# Altium schematic sheet Compute_Module_POWER.SchDoc: STM32F446 CNC
size B; Author: AM; CompanyName: Expatria Technologies; DrawnBy: A.Marles; Engineer: AM; Organization: Expatria Technolgoies; Address1: 1136 Glade Court; Address3: Port Coquitlam, BC V3B 1R5; Address4: Canada; DocumentNumber: 9; SheetNumber: 9; SheetTotal: 30
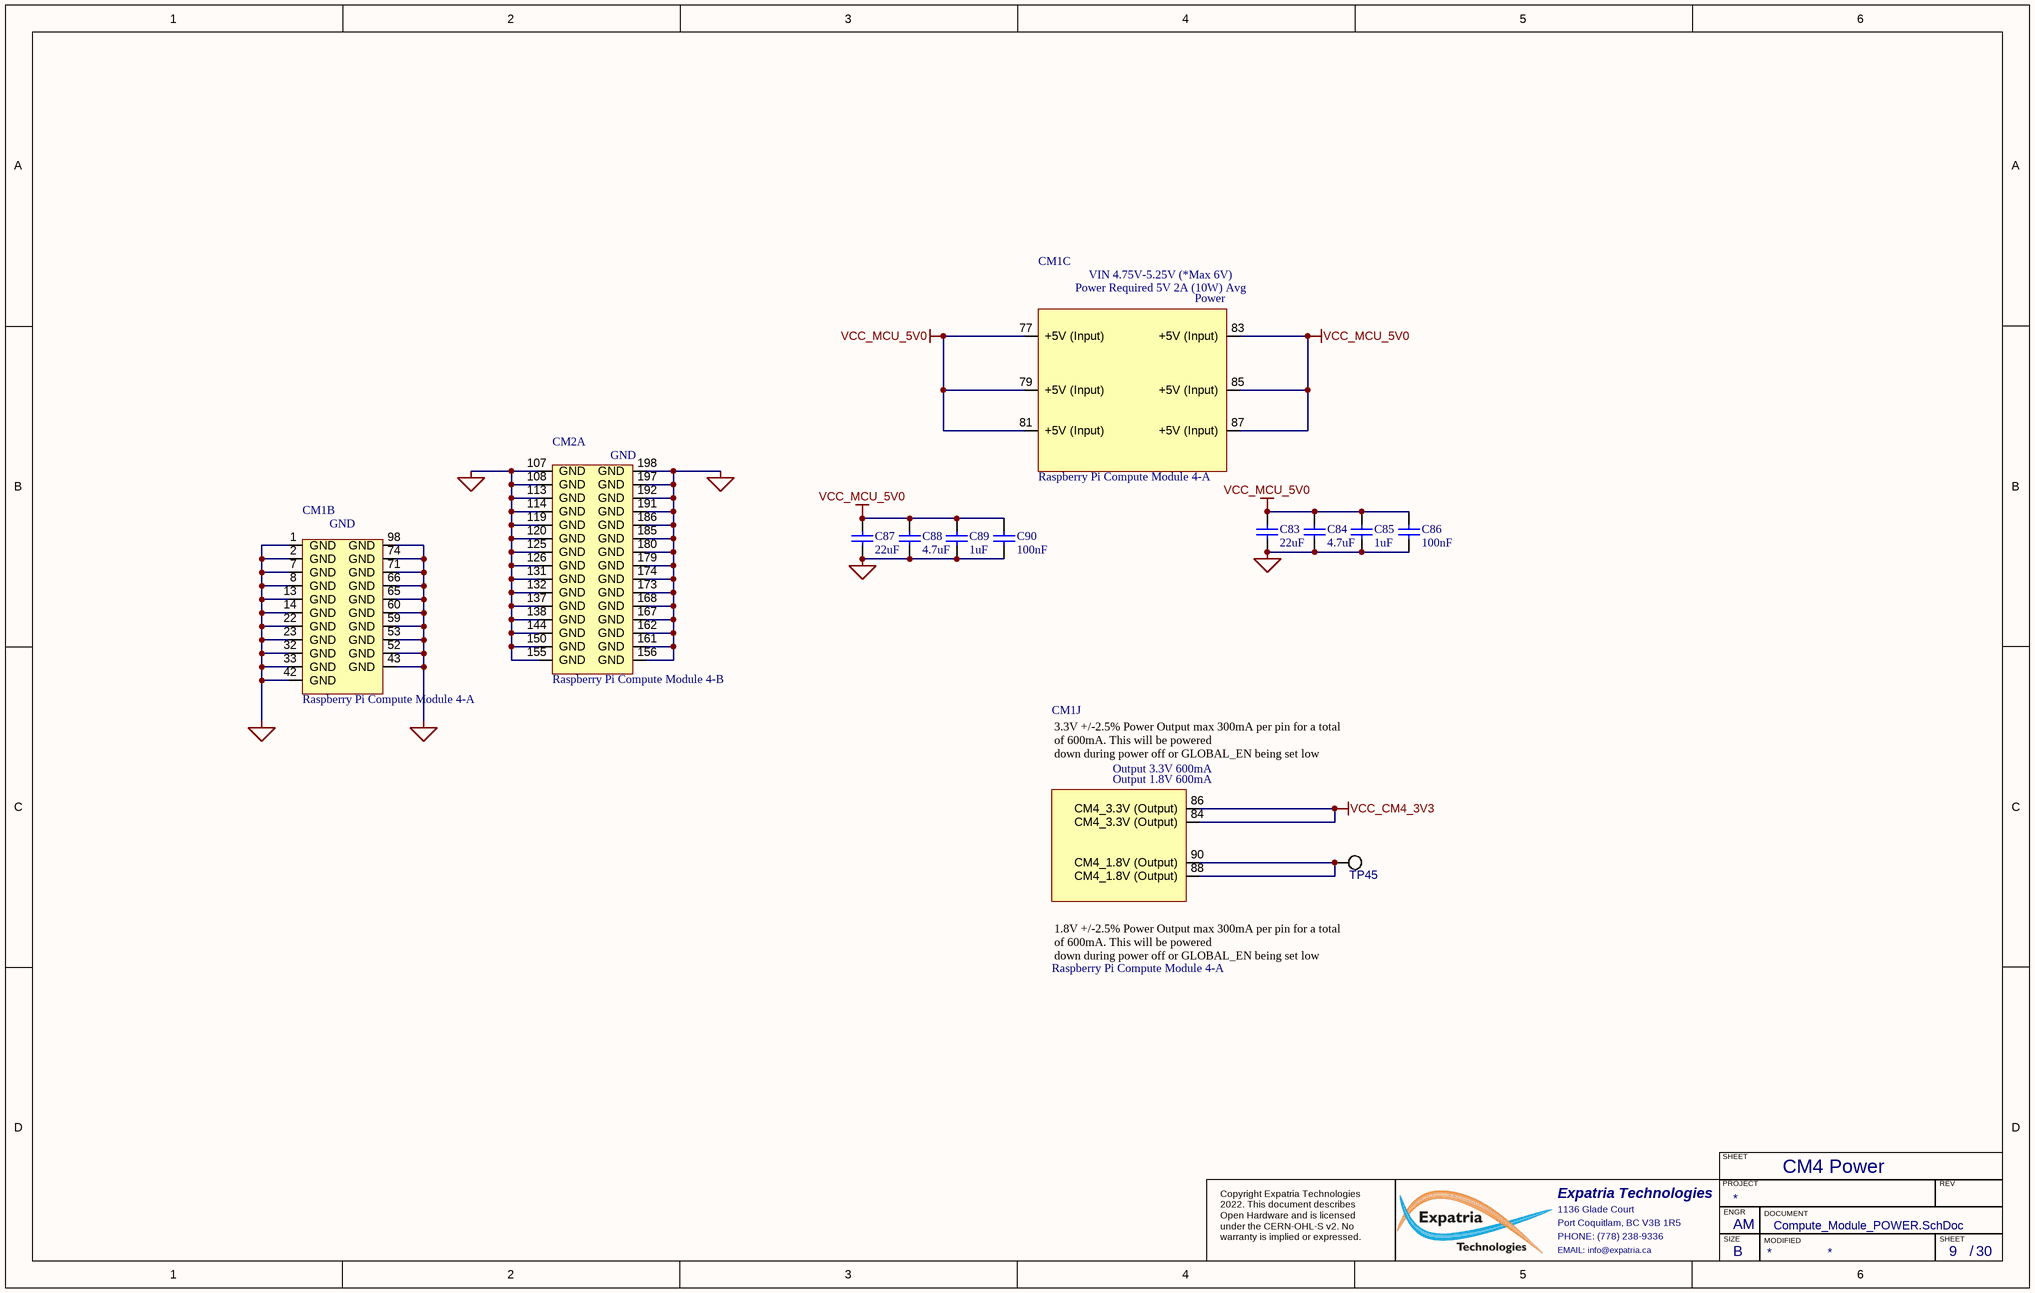
[diagram p0: Compute_Module_POWER.SchDoc]

## Parts
C83  22uF  [0805_C]
C84  4.7uF  [0603_C]
C85  1uF  [0603_C]
C86  100nF  [0603_C]
C87  22uF  [0805_C]
C88  4.7uF  [0603_C]
C89  1uF  [0603_C]
C90  100nF  [0603_C]
CM1  Raspberry Pi Compute Module 4-A  [DF40HC30100DS04V51]  (parts B,C,J of 14)
CM2  Raspberry Pi Compute Module 4-B  [DF40HC30100DS04V51 - p101-200]  (part A of 10)
TP45  TESTPOINT  [TP/SMALL]  (value not drawn)  (no BOM)

## Nets
MCU_GND: C83.1 C84.1 C85.1 C86.1 C87.1 C88.1 C89.1 C90.1 CM1.1(GND) CM1.2(GND) CM1.7(GND) CM1.8(GND) CM1.13(GND) CM1.14(GND) CM1.22(GND) CM1.23(GND) CM1.32(GND) CM1.33(GND) CM1.42(GND) CM1.43(GND) CM1.52(GND) CM1.53(GND) CM1.59(GND) CM1.60(GND) CM1.65(GND) CM1.66(GND) CM1.71(GND) CM1.74(GND) CM1.98(GND) CM2.107(GND) CM2.108(GND) CM2.113(GND) CM2.114(GND) CM2.119(GND) CM2.120(GND) CM2.125(GND) CM2.126(GND) CM2.131(GND) CM2.132(GND) CM2.137(GND) CM2.138(GND) CM2.144(GND) CM2.150(GND) CM2.155(GND) CM2.156(GND) CM2.161(GND) CM2.162(GND) CM2.167(GND) CM2.168(GND) CM2.173(GND) CM2.174(GND) CM2.179(GND) CM2.180(GND) CM2.185(GND) CM2.186(GND) CM2.191(GND) CM2.192(GND) CM2.197(GND) CM2.198(GND)
VCC_CM4_3V3: CM1.84(CM4_3.3V_(Output)) CM1.86(CM4_3.3V_(Output))
VCC_MCU_5V0: C83.2 C84.2 C85.2 C86.2 C87.2 C88.2 C89.2 C90.2 CM1.77(+5V_(Input)) CM1.79(+5V_(Input)) CM1.81(+5V_(Input)) CM1.83(+5V_(Input)) CM1.85(+5V_(Input)) CM1.87(+5V_(Input))
NetCM1_88: CM1.88(CM4_1.8V_(Output)) CM1.90(CM4_1.8V_(Output)) TP45.1

## Notes on the sheet
- CM4 Power
- SHEET
- Expatria Technologies
- 1136 Glade Court
- Port Coquitlam, BC V3B 1R5
- PHONE: (778) 238-9336
- PROJECT
- SIZE
- ENGR
- MODIFIED
- DOCUMENT
- REV
- Copyright Expatria Technologies 2022. This document describes Open Hardware and is licensed under the CERN-OHL-S v2. No warranty is implied or expressed.
- EMAIL: info@expatria.ca
- B
- /
- (in symbol CM4_Module_A, part C) VIN 4.75V-5.25V (*Max 6V); Power Required 5V 2A (10W) Avg; Power; by Amornthep Phunsin
- (in symbol CM4_Module_A, part J) 3.3V +/-2.5% Power Output max 300mA per pin for a total of 600mA. This will be powered / down during power off or GLOBAL_EN being set low; Output 3.3V 600mA; Output 1.8V 600mA; 1.8V +/-2.5% Power Output max 300mA per pin for a total of 600mA. This will be powered / down during power off or GLOBAL_EN being set low

## Library data of the parts
C83 C87 = 0805 22uF (226) 20% 25V: Chip capacitors; Manufacturer: Samsung Electro-Mechanics; PartNumber: CL21A226MAQNNNE; Tolerance: 20%; Voltage: 25V; Package: 0805; Supplier: LCSC; SuppliersPartNumber: C45783; Capacitance: 22uF; ComponentLink1Description: Supplier link; ComponentLink1URL: http://www.szlcsc.com/product/details_46786.html; Manufacturer Part Number: CL21A226MAQNNNE
C84 C88 = 0603 4.7uF (475) 10% 16V: Chip capacitors; Manufacturer: Samsung Electro-Mechanics; PartNumber: CL10A475KO8NNNC; Tolerance: 10%; Voltage: 16V; ComponentLink1Description: Supplier link; ComponentLink1URL: http://www.szlcsc.com/product/details_20375.html; Package: 0603; Supplier: LCSC; SuppliersPartNumber: C19666; Capacitance: 4.7uF; Manufacturer Part Number: CL10A475KO8NNNC
C85 C89 = 0603 1uF (105) 10% 50V: Chip capacitors; Manufacturer: Samsung Electro-Mechanics; Manufacturer Part Number: CL10A105KB8NNNC; Tolerance: 10%; Voltage: 50V; ComponentLink1Description: Supplier link; ComponentLink1URL: http://www.szlcsc.com/product/details_16531.html; Package: 0603; Supplier: LCSC; SuppliersPartNumber: C15849; Capacitance: 1uF
C86 C90 = 0603 100nF (104) 10% 50V: Chip capacitors; Manufacturer: YAGEO; Manufacturer Part Number: CC0603KRX7R9BB104; Tolerance: 10%; Voltage: 50V; ComponentLink1Description: Supplier link; ComponentLink1URL: http://www.szlcsc.com/product/details_15331.html; Package: 0603; Supplier: LCSC; SuppliersPartNumber: C14663; Capacitance: 100nF
CM1 = CM4_Module_A: Raspberry Pi Compute Module 4 Pins 1-100 (Connector A); Manufacturer: Hirose; Manufacturer Part Number: DF40HC(3.0)-100DS-0.4V(51); SuppliersPartNumber: C424649; Supplier: LCSC; Value: CM4_Module_A
CM2 = CM4_Module_B: Raspberry Pi Compute Module 4 Pins 101-200 (Connector B); Manufacturer: Hirose; Manufacturer Part Number: DF40HC(3.0)-100DS-0.4V(51); SuppliersPartNumber: C424649; Supplier: LCSC; Value: CM4_Module_B
TP45 = TESTPOINT: Test Point; Manufacturer 1: N/A; Manufacturer Part Number 1: N/A; Value: Testpoint